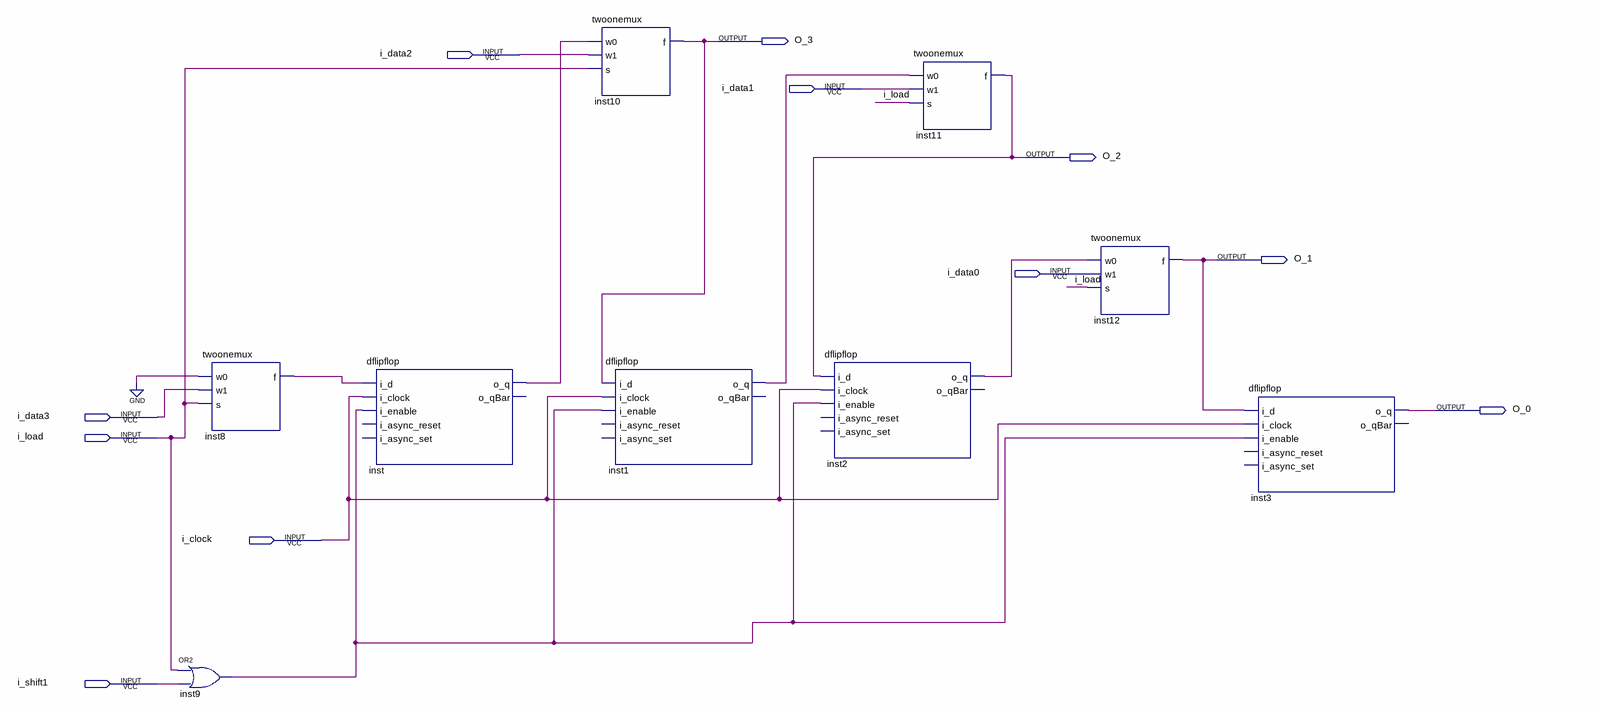
[diagram p0: schematic sheet]
// Quartus schematic Shift_4bit.bdf as structural Verilog: 9 symbols, 11 pins
module Shift_4bit (
  input  i_data2,
  input  i_data1,
  input  i_data0,
  input  i_data3,
  input  i_load,
  input  i_clock,
  input  i_shift1,
  output O_3,
  output O_2,
  output O_1,
  output O_0
);

  wire inst1_o_q, inst2_o_q, inst8_f, inst9_out, inst_o_q;

  twoonemux inst8 (.w0(1'b0), .w1(i_data3), .s(i_load), .f(inst8_f));
  or inst9 (inst9_out, i_load, i_shift1);
  dflipflop inst (
    .i_d(inst8_f), .i_clock(i_clock), .i_enable(inst9_out), .o_q(inst_o_q));  // open: i_async_reset, i_async_set, o_qBar
  twoonemux inst10 (.w0(inst_o_q), .w1(i_data2), .s(i_load), .f(O_3));
  dflipflop inst1 (
    .i_d(O_3), .i_clock(i_clock), .i_enable(inst9_out), .o_q(inst1_o_q));  // open: i_async_reset, i_async_set, o_qBar
  dflipflop inst2 (
    .i_d(O_2), .i_clock(i_clock), .i_enable(inst9_out), .o_q(inst2_o_q));  // open: i_async_reset, i_async_set, o_qBar
  twoonemux inst11 (.w0(inst1_o_q), .w1(i_data1), .s(i_load), .f(O_2));
  twoonemux inst12 (.w0(inst2_o_q), .w1(i_data0), .s(i_load), .f(O_1));
  dflipflop inst3 (
    .i_d(O_1), .i_clock(i_clock), .i_enable(inst9_out), .o_q(O_0));  // open: i_async_reset, i_async_set, o_qBar
endmodule
